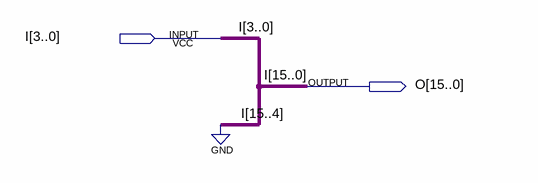
[diagram p0: schematic sheet]
// Quartus schematic 4to16.bdf as structural Verilog: 0 symbols, 2 pins
module \4to16  (
  input  [3:0] I,
  output [15:0] O
);


  assign O = {{12{1'b0}}, I};
endmodule
